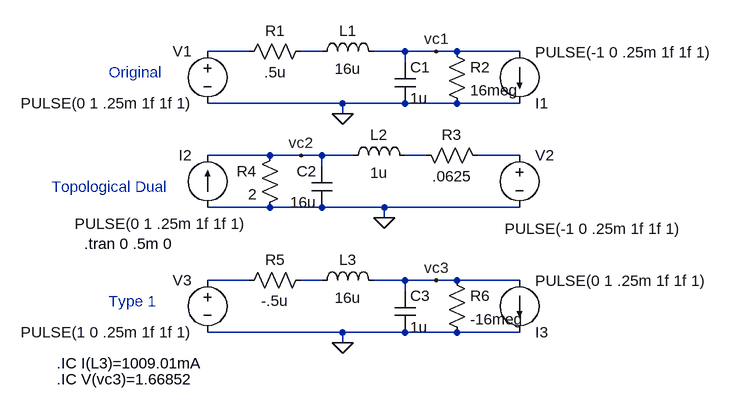
[diagram p0: schematic problem2.asc]
problem2.asc, the LTspice schematic file:
Version 4
SHEET 1 1332 680
WIRE 112 128 48 128
WIRE 224 128 192 128
WIRE 352 128 304 128
WIRE 400 128 352 128
WIRE 432 128 400 128
WIRE 528 128 432 128
WIRE 352 144 352 128
WIRE 256 208 48 208
WIRE 352 208 256 208
WIRE 432 208 352 208
WIRE 528 208 432 208
WIRE 256 224 256 208
WIRE 144 288 48 288
WIRE 192 288 144 288
WIRE 224 288 192 288
WIRE 272 288 224 288
WIRE 384 288 352 288
WIRE 528 288 464 288
WIRE 224 304 224 288
WIRE 144 368 48 368
WIRE 224 368 144 368
WIRE 320 368 224 368
WIRE 528 368 320 368
WIRE 320 384 320 368
WIRE 112 480 48 480
WIRE 224 480 192 480
WIRE 352 480 304 480
WIRE 400 480 352 480
WIRE 432 480 400 480
WIRE 528 480 432 480
WIRE 352 496 352 480
WIRE 256 560 48 560
WIRE 352 560 256 560
WIRE 432 560 352 560
WIRE 528 560 432 560
WIRE 256 576 256 560
FLAG 256 224 0
FLAG 320 384 0
FLAG 192 288 vc2
FLAG 400 128 vc1
FLAG 256 576 0
FLAG 400 480 vc3
SYMBOL voltage 48 112 M0
WINDOW 123 0 0 Left 2
WINDOW 39 0 0 Left 2
SYMATTR InstName V1
SYMATTR Value PULSE(0 1 .25m 1f 1f 1)
SYMBOL current 528 128 R0
WINDOW 0 24 80 Left 2
WINDOW 3 24 1 Left 2
WINDOW 123 0 0 Left 2
WINDOW 39 0 0 Left 2
SYMATTR InstName I1
SYMATTR Value PULSE(-1 0 .25m 1f 1f 1)
SYMBOL res 96 144 R270
WINDOW 0 32 56 VTop 2
WINDOW 3 0 56 VBottom 2
SYMATTR InstName R1
SYMATTR Value .5u
SYMBOL ind 208 144 R270
WINDOW 0 32 56 VTop 2
WINDOW 3 5 56 VBottom 2
SYMATTR InstName L1
SYMATTR Value 16u
SYMBOL cap 336 144 R0
SYMATTR InstName C1
SYMATTR Value 1u
SYMBOL res 416 112 R0
SYMATTR InstName R2
SYMATTR Value 16meg
SYMBOL voltage 528 272 R0
WINDOW 3 -23 129 Left 2
WINDOW 123 0 0 Left 2
WINDOW 39 0 0 Left 2
SYMATTR InstName V2
SYMATTR Value PULSE(-1 0 .25m 1f 1f 1)
SYMBOL current 48 368 R180
WINDOW 0 24 80 Left 2
WINDOW 3 -59 -25 Left 2
WINDOW 123 0 0 Left 2
WINDOW 39 0 0 Left 2
SYMATTR InstName I2
SYMATTR Value PULSE(0 1 .25m 1f 1f 1)
SYMBOL res 480 304 M270
WINDOW 0 32 56 VTop 2
WINDOW 3 0 56 VBottom 2
SYMATTR InstName R3
SYMATTR Value .0625
SYMBOL ind 368 304 M270
WINDOW 0 32 56 VTop 2
WINDOW 3 5 56 VBottom 2
SYMATTR InstName L2
SYMATTR Value 1u
SYMBOL cap 240 304 M0
SYMATTR InstName C2
SYMATTR Value 16u
SYMBOL res 160 272 M0
SYMATTR InstName R4
SYMATTR Value 2
SYMBOL voltage 48 464 M0
WINDOW 123 0 0 Left 2
WINDOW 39 0 0 Left 2
SYMATTR InstName V3
SYMATTR Value PULSE(1 0 .25m 1f 1f 1)
SYMBOL current 528 480 R0
WINDOW 0 24 80 Left 2
WINDOW 3 24 1 Left 2
WINDOW 123 0 0 Left 2
WINDOW 39 0 0 Left 2
SYMATTR InstName I3
SYMATTR Value PULSE(0 1 .25m 1f 1f 1)
SYMBOL res 96 496 R270
WINDOW 0 32 56 VTop 2
WINDOW 3 0 56 VBottom 2
SYMATTR InstName R5
SYMATTR Value -.5u
SYMBOL ind 208 496 R270
WINDOW 0 32 56 VTop 2
WINDOW 3 5 56 VBottom 2
SYMATTR InstName L3
SYMATTR Value 16u
SYMBOL cap 336 496 R0
SYMATTR InstName C3
SYMATTR Value 1u
SYMBOL res 416 464 R0
SYMATTR InstName R6
SYMATTR Value -16meg
TEXT -142 424 Left 2 !.tran 0 .5m 0
TEXT -104 160 Left 2 ;Original
TEXT -192 336 Left 2 ;Topological Dual
TEXT -104 512 Left 2 ;Type 1
TEXT -184 608 Left 2 !.IC I(L3)=1009.01mA
TEXT -184 632 Left 2 !.IC V(vc3)=1.66852

The netlist it stands for:
* problem2.asc
V1 N001 0 PULSE(0 1 .25m 1f 1f 1)
I1 vc1 0 PULSE(-1 0 .25m 1f 1f 1)
R1 N001 N002 .5u
L1 N002 vc1 16u
C1 vc1 0 1u
R2 vc1 0 16meg
V2 N004 0 PULSE(-1 0 .25m 1f 1f 1)
I2 0 vc2 PULSE(0 1 .25m 1f 1f 1)
R3 N004 N003 .0625
L2 N003 vc2 1u
C2 vc2 0 16u
R4 vc2 0 2
V3 N005 0 PULSE(1 0 .25m 1f 1f 1)
I3 vc3 0 PULSE(0 1 .25m 1f 1f 1)
R5 N005 N006 -.5u
L3 N006 vc3 16u
C3 vc3 0 1u
R6 vc3 0 -16meg
.tran 0 .5m 0
* Original
* Topological Dual
* Type 1
.IC I(L3)=1009.01mA
.IC V(vc3)=1.66852
.backanno
.end

* Results of the author's LTspice run, read from the files saved beside the schematic
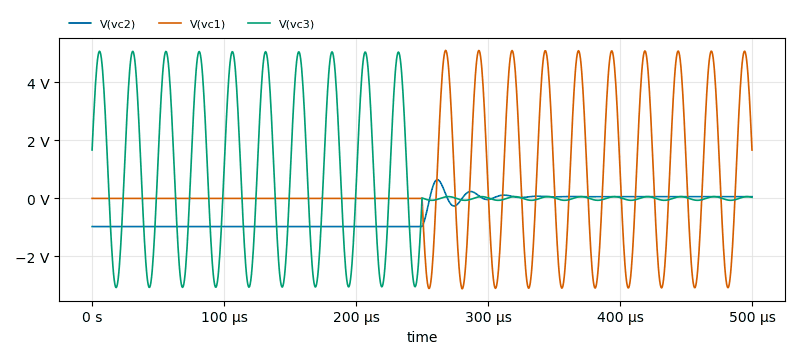
[diagram p1: Transient Analysis of problem2.asc, plotted from the saved traces]
* Transient Analysis, 1 run:
*   V(vc2): min -969.2 mV, max 643.8 mV, average -454.9 mV, rms 694.9 mV, last 61.54 mV
*   V(vc1): min -3.115 V, max 5.104 V, average 500.8 mV, rms 2.171 V, last 1.669 V
*   V(vc3): min -3.074 V, max 5.074 V, average 500.1 mV, rms 2.156 V, last 38.42 mV